# Altium schematic sheet TOP SHEET.SchDoc
size 420 x 297 mm; SheetNumber: 1; SheetTotal: 27
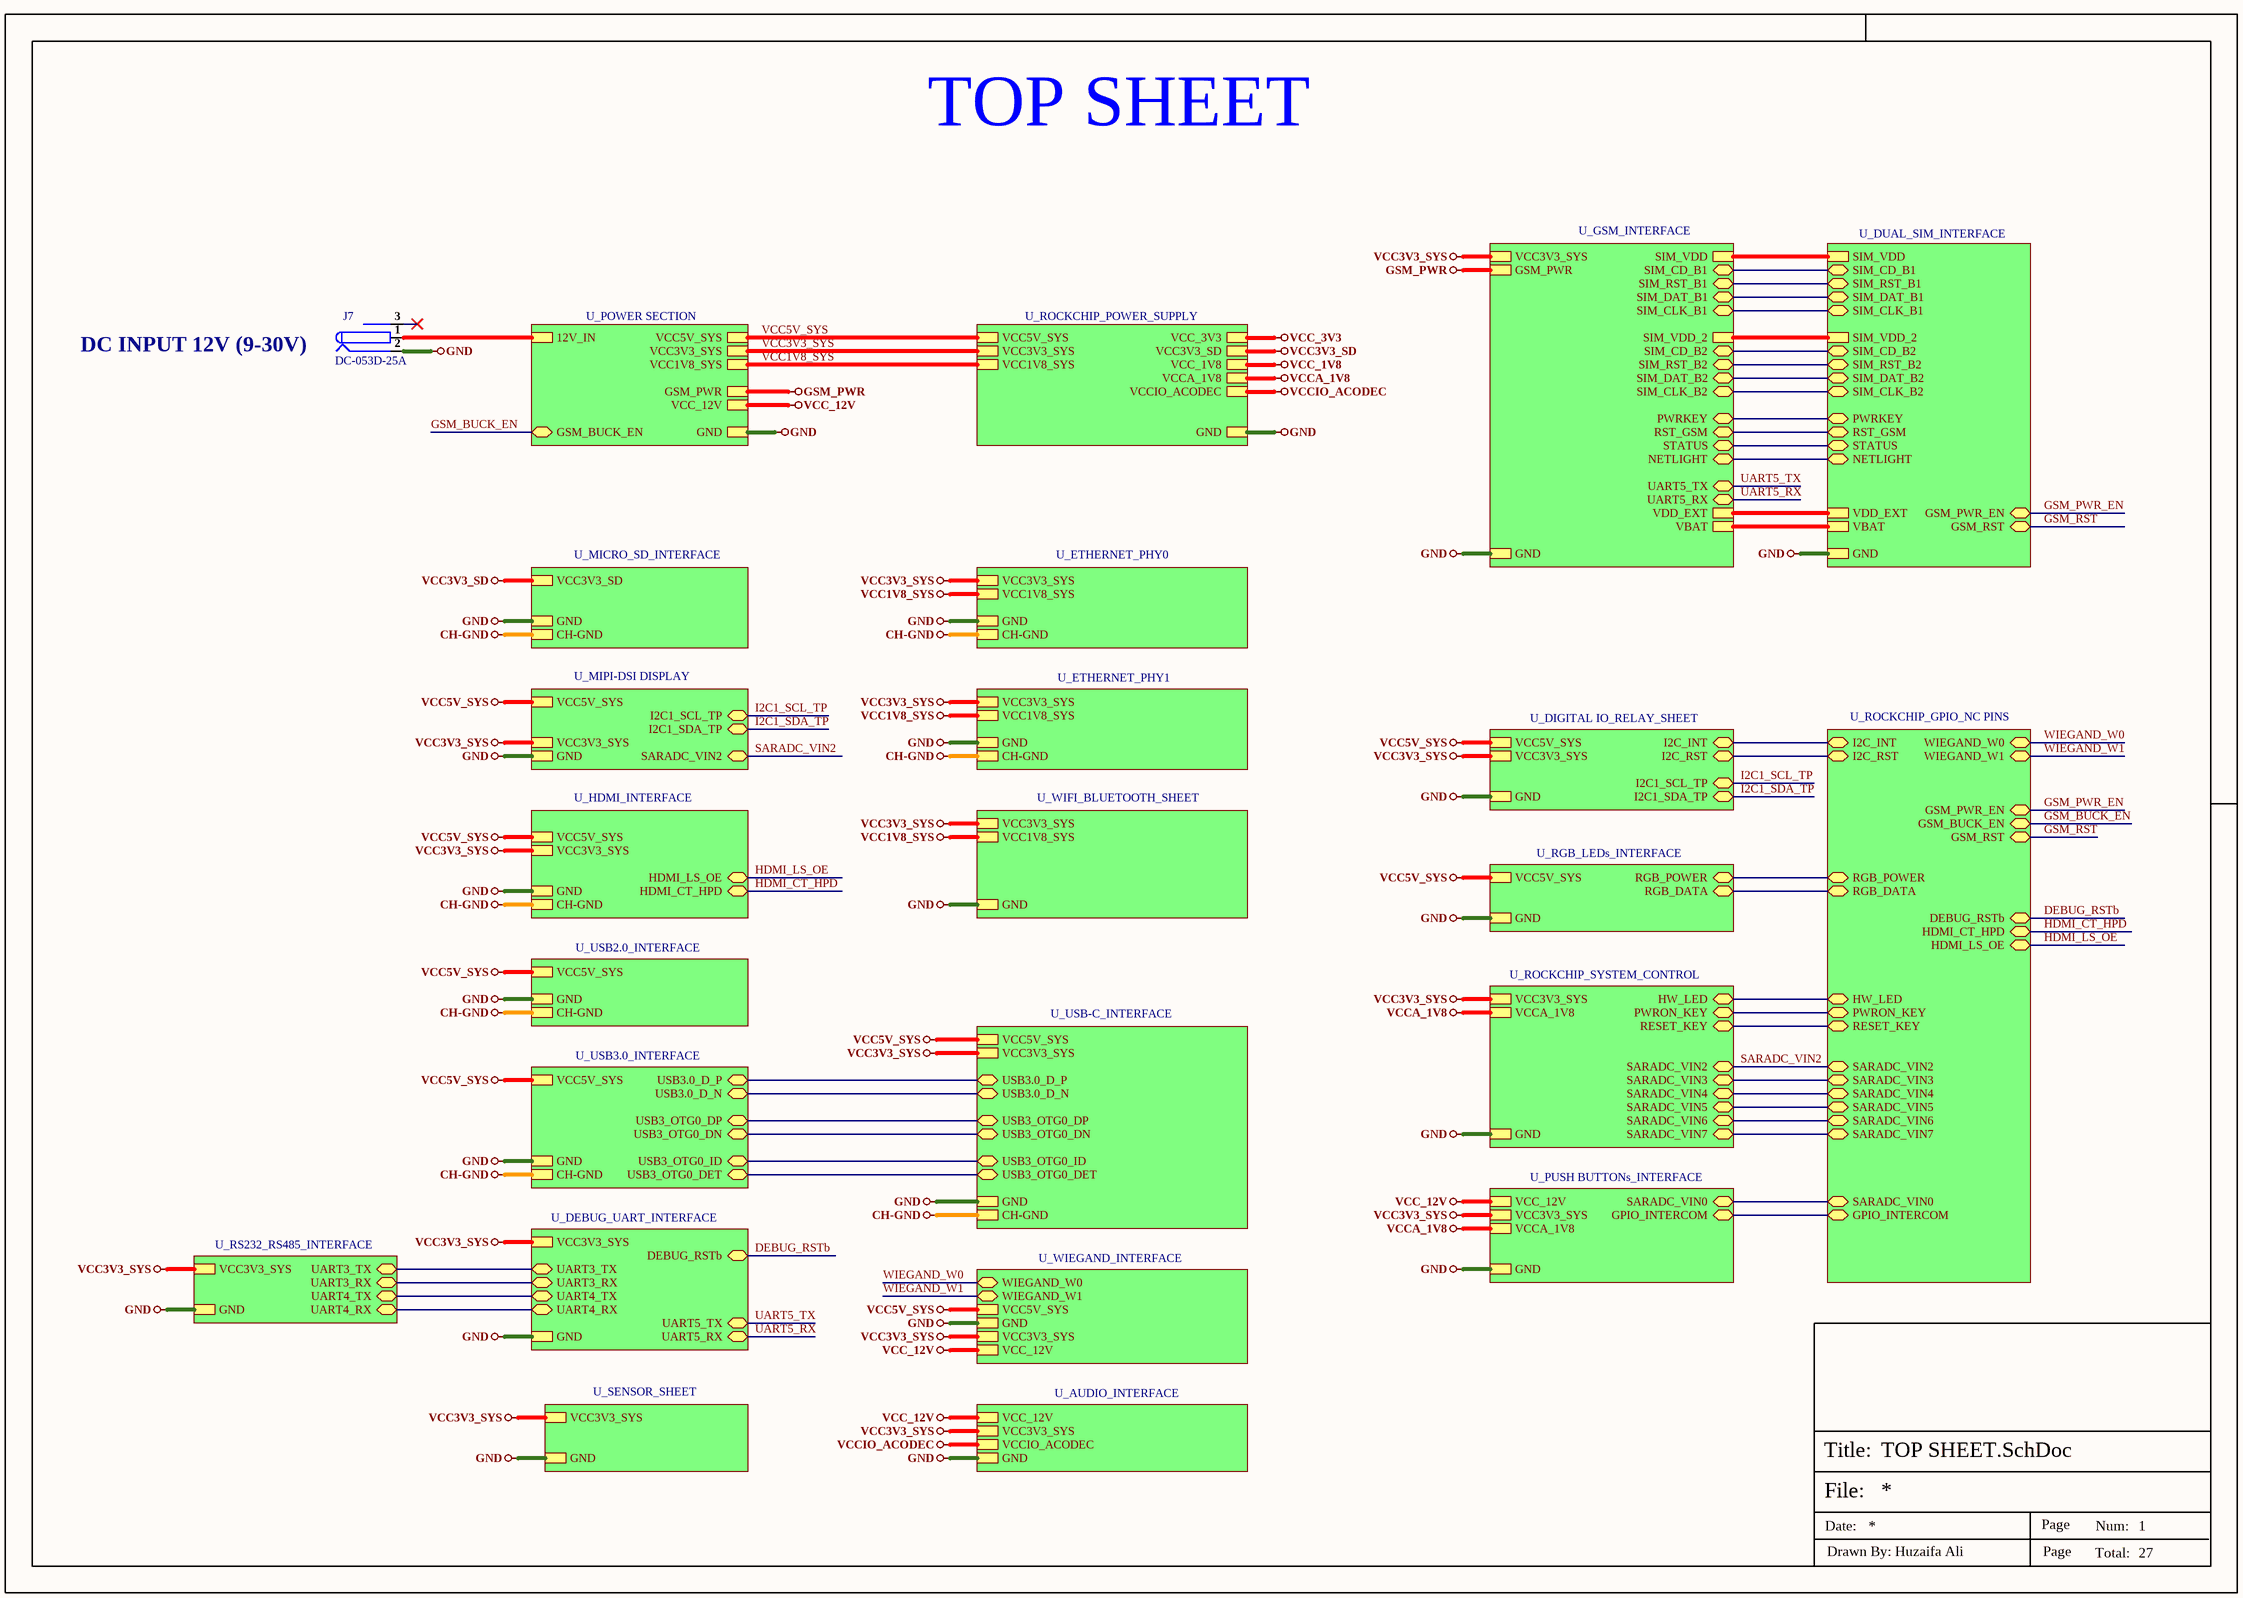
[diagram p0: TOP SHEET.SchDoc]

## Parts
J7  DC-053D-25A  [DC-053D-25A]

## Sub-sheets
U_AUDIO_INTERFACE = AUDIO_INTERFACE.SchDoc: GND, VCC3V3_SYS, VCC_12V, VCCIO_ACODEC
U_DEBUG_UART_INTERFACE = DEBUG_UART_INTERFACE.SchDoc: UART5_TX (bidir), UART5_RX (bidir), UART3_TX (bidir), UART3_RX (bidir), UART4_TX (bidir), UART4_RX (bidir), GND, VCC3V3_SYS, DEBUG_RSTb (bidir)
U_DIGITAL IO_RELAY_SHEET = DIGITAL IO_RELAY_SHEET.SchDoc: VCC5V_SYS, GND, VCC3V3_SYS, I2C_INT (bidir), I2C_RST (bidir), I2C1_SCL_TP (bidir), I2C1_SDA_TP (bidir)
U_DUAL_SIM_INTERFACE = DUAL_SIM_INTERFACE.SchDoc: SIM_CD_B2 (bidir), SIM_RST_B2 (bidir), SIM_DAT_B2 (bidir), SIM_CLK_B2 (bidir), SIM_CD_B1 (bidir), SIM_RST_B1 (bidir), SIM_DAT_B1 (bidir), SIM_CLK_B1 (bidir), SIM_VDD, SIM_VDD_2, GND, VBAT, PWRKEY (bidir), RST_GSM (bidir), STATUS (bidir), NETLIGHT (bidir), GSM_PWR_EN (bidir), GSM_RST (bidir), VDD_EXT
U_ETHERNET_PHY0 = ETHERNET_PHY0.SchDoc: GND, VCC3V3_SYS, VCC1V8_SYS, CH-GND
U_ETHERNET_PHY1 = ETHERNET_PHY1.SchDoc: GND, VCC3V3_SYS, VCC1V8_SYS, CH-GND
U_GSM_INTERFACE = GSM_INTERFACE.SchDoc: GSM_PWR, GND, SIM_CD_B2 (bidir), SIM_RST_B2 (bidir), SIM_DAT_B2 (bidir), SIM_CLK_B2 (bidir), SIM_CD_B1 (bidir), SIM_RST_B1 (bidir), SIM_DAT_B1 (bidir), SIM_CLK_B1 (bidir), PWRKEY (bidir), RST_GSM (bidir), STATUS (bidir), NETLIGHT (bidir), VDD_EXT, VBAT, VCC3V3_SYS, SIM_VDD, SIM_VDD_2, UART5_TX (bidir), UART5_RX (bidir)
U_HDMI_INTERFACE = HDMI_INTERFACE.SchDoc: VCC5V_SYS, GND, CH-GND, VCC3V3_SYS, HDMI_CT_HPD (bidir), HDMI_LS_OE (bidir)
U_MICRO_SD_INTERFACE = MICRO_SD_INTERFACE.SchDoc: GND, VCC3V3_SD, CH-GND
U_MIPI-DSI DISPLAY = MIPI-DSI DISPLAY.SchDoc: VCC5V_SYS, GND, VCC3V3_SYS, I2C1_SCL_TP (bidir), I2C1_SDA_TP (bidir), SARADC_VIN2 (bidir)
U_POWER SECTION = POWER SECTION.SchDoc: 12V_IN, VCC5V_SYS, GND, VCC3V3_SYS, GSM_PWR, VCC1V8_SYS, GSM_BUCK_EN (bidir), VCC_12V
U_PUSH BUTTONs_INTERFACE = PUSH BUTTONs_INTERFACE.SchDoc: GND, VCC3V3_SYS, VCCA_1V8, SARADC_VIN0 (bidir), GPIO_INTERCOM (bidir), VCC_12V
U_RGB_LEDs_INTERFACE = RGB_LEDs_INTERFACE.SchDoc: RGB_POWER (bidir), RGB_DATA (bidir), VCC5V_SYS, GND
U_ROCKCHIP_GPIO_NC PINS = ROCKCHIP_GPIO_NC PINS.SchDoc: WIEGAND_W1 (bidir), WIEGAND_W0 (bidir), RGB_POWER (bidir), RGB_DATA (bidir), HDMI_CT_HPD (bidir), HDMI_LS_OE (bidir), GSM_PWR_EN (bidir), GSM_RST (bidir), GSM_BUCK_EN (bidir), DEBUG_RSTb (bidir), I2C_INT (bidir), I2C_RST (bidir), SARADC_VIN0 (bidir), GPIO_INTERCOM (bidir), HW_LED (bidir), PWRON_KEY (bidir), RESET_KEY (bidir), SARADC_VIN3 (bidir), SARADC_VIN4 (bidir), SARADC_VIN5 (bidir), SARADC_VIN6 (bidir), SARADC_VIN7 (bidir), SARADC_VIN2 (bidir)
U_ROCKCHIP_POWER_SUPPLY = ROCKCHIP_PWR_SUPPLY.SchDoc: VCC5V_SYS, GND, VCC3V3_SYS, VCC3V3_SD, VCC1V8_SYS, VCCIO_ACODEC, VCCA_1V8, VCC_1V8, VCC_3V3
U_ROCKCHIP_SYSTEM_CONTROL = ROCKCHIP_SYSTEM_CONTROL.SchDoc: GND, VCC3V3_SYS, HW_LED (bidir), PWRON_KEY (bidir), RESET_KEY (bidir), SARADC_VIN3 (bidir), VCCA_1V8, SARADC_VIN4 (bidir), SARADC_VIN5 (bidir), SARADC_VIN6 (bidir), SARADC_VIN7 (bidir), SARADC_VIN2 (bidir)
U_RS232_RS485_INTERFACE = RS232_RS485_INTERFACE.SchDoc: UART3_TX (bidir), UART3_RX (bidir), UART4_TX (bidir), UART4_RX (bidir), GND, VCC3V3_SYS
U_SENSOR_SHEET = SENSOR_SHEET.SchDoc: GND, VCC3V3_SYS
U_USB2.0_INTERFACE = USB2.0_INTERFACE.SchDoc: VCC5V_SYS, GND, CH-GND
U_USB3.0_INTERFACE = USB3.0_INTERFACE.SchDoc: VCC5V_SYS, GND, CH-GND, USB3_OTG0_DP (bidir), USB3_OTG0_DN (bidir), USB3.0_D_P (bidir), USB3.0_D_N (bidir), USB3_OTG0_ID (bidir), USB3_OTG0_DET (bidir)
U_USB-C_INTERFACE = USB-C_INTERFACE.SchDoc: USB3_OTG0_DP (bidir), USB3_OTG0_DN (bidir), USB3.0_D_P (bidir), USB3.0_D_N (bidir), USB3_OTG0_ID (bidir), USB3_OTG0_DET (bidir), VCC5V_SYS, GND, CH-GND, VCC3V3_SYS
U_WIEGAND_INTERFACE = WIEGAND_INTERFACE.SchDoc: WIEGAND_W1 (bidir), WIEGAND_W0 (bidir), VCC5V_SYS, GND, VCC3V3_SYS, VCC_12V
U_WIFI_BLUETOOTH_SHEET = WIFI_BLUETOOTH_SHEET.SchDoc: GND, VCC3V3_SYS, VCC1V8_SYS

## Nets
CH-GND: sheet U_MICRO_SD_INTERFACE/CH-GND, sheet U_HDMI_INTERFACE/CH-GND, sheet U_USB2.0_INTERFACE/CH-GND, sheet U_USB3.0_INTERFACE/CH-GND, sheet U_USB-C_INTERFACE/CH-GND, sheet U_ETHERNET_PHY0/CH-GND, sheet U_ETHERNET_PHY1/CH-GND
GND: J7.2 ; sheet U_POWER SECTION/GND, sheet U_ROCKCHIP_POWER_SUPPLY/GND, sheet U_MICRO_SD_INTERFACE/GND, sheet U_HDMI_INTERFACE/GND, sheet U_MIPI-DSI DISPLAY/GND, sheet U_USB2.0_INTERFACE/GND, sheet U_USB3.0_INTERFACE/GND, sheet U_USB-C_INTERFACE/GND, sheet U_ETHERNET_PHY0/GND, sheet U_ETHERNET_PHY1/GND, sheet U_WIFI_BLUETOOTH_SHEET/GND, sheet U_GSM_INTERFACE/GND, sheet U_DUAL_SIM_INTERFACE/GND, sheet U_RS232_RS485_INTERFACE/GND, sheet U_DEBUG_UART_INTERFACE/GND, sheet U_AUDIO_INTERFACE/GND, sheet U_WIEGAND_INTERFACE/GND, sheet U_SENSOR_SHEET/GND, sheet U_ROCKCHIP_SYSTEM_CONTROL/GND, sheet U_RGB_LEDs_INTERFACE/GND, sheet U_PUSH BUTTONs_INTERFACE/GND, sheet U_DIGITAL IO_RELAY_SHEET/GND
GSM_PWR: sheet U_POWER SECTION/GSM_PWR, sheet U_GSM_INTERFACE/GSM_PWR
VCC1V8_SYS: sheet U_POWER SECTION/VCC1V8_SYS, sheet U_ROCKCHIP_POWER_SUPPLY/VCC1V8_SYS, sheet U_ETHERNET_PHY0/VCC1V8_SYS, sheet U_ETHERNET_PHY1/VCC1V8_SYS, sheet U_WIFI_BLUETOOTH_SHEET/VCC1V8_SYS
VCC3V3_SD: sheet U_ROCKCHIP_POWER_SUPPLY/VCC3V3_SD, sheet U_MICRO_SD_INTERFACE/VCC3V3_SD
VCC3V3_SYS: sheet U_POWER SECTION/VCC3V3_SYS, sheet U_ROCKCHIP_POWER_SUPPLY/VCC3V3_SYS, sheet U_HDMI_INTERFACE/VCC3V3_SYS, sheet U_MIPI-DSI DISPLAY/VCC3V3_SYS, sheet U_USB-C_INTERFACE/VCC3V3_SYS, sheet U_ETHERNET_PHY0/VCC3V3_SYS, sheet U_ETHERNET_PHY1/VCC3V3_SYS, sheet U_WIFI_BLUETOOTH_SHEET/VCC3V3_SYS, sheet U_GSM_INTERFACE/VCC3V3_SYS, sheet U_RS232_RS485_INTERFACE/VCC3V3_SYS, sheet U_DEBUG_UART_INTERFACE/VCC3V3_SYS, sheet U_AUDIO_INTERFACE/VCC3V3_SYS, sheet U_WIEGAND_INTERFACE/VCC3V3_SYS, sheet U_SENSOR_SHEET/VCC3V3_SYS, sheet U_ROCKCHIP_SYSTEM_CONTROL/VCC3V3_SYS, sheet U_PUSH BUTTONs_INTERFACE/VCC3V3_SYS, sheet U_DIGITAL IO_RELAY_SHEET/VCC3V3_SYS
VCC5V_SYS: sheet U_POWER SECTION/VCC5V_SYS, sheet U_ROCKCHIP_POWER_SUPPLY/VCC5V_SYS, sheet U_HDMI_INTERFACE/VCC5V_SYS, sheet U_MIPI-DSI DISPLAY/VCC5V_SYS, sheet U_USB2.0_INTERFACE/VCC5V_SYS, sheet U_USB3.0_INTERFACE/VCC5V_SYS, sheet U_USB-C_INTERFACE/VCC5V_SYS, sheet U_WIEGAND_INTERFACE/VCC5V_SYS, sheet U_RGB_LEDs_INTERFACE/VCC5V_SYS, sheet U_DIGITAL IO_RELAY_SHEET/VCC5V_SYS
VCC_1V8: sheet U_ROCKCHIP_POWER_SUPPLY/VCC_1V8
VCC_3V3: sheet U_ROCKCHIP_POWER_SUPPLY/VCC_3V3
VCC_12V: sheet U_POWER SECTION/VCC_12V, sheet U_AUDIO_INTERFACE/VCC_12V, sheet U_WIEGAND_INTERFACE/VCC_12V, sheet U_PUSH BUTTONs_INTERFACE/VCC_12V
VCCA_1V8: sheet U_ROCKCHIP_POWER_SUPPLY/VCCA_1V8, sheet U_ROCKCHIP_SYSTEM_CONTROL/VCCA_1V8, sheet U_PUSH BUTTONs_INTERFACE/VCCA_1V8
VCCIO_ACODEC: sheet U_ROCKCHIP_POWER_SUPPLY/VCCIO_ACODEC, sheet U_AUDIO_INTERFACE/VCCIO_ACODEC
DEBUG_RSTb: sheet U_DEBUG_UART_INTERFACE/DEBUG_RSTb, sheet U_ROCKCHIP_GPIO_NC PINS/DEBUG_RSTb
GSM_BUCK_EN: sheet U_POWER SECTION/GSM_BUCK_EN, sheet U_ROCKCHIP_GPIO_NC PINS/GSM_BUCK_EN
GSM_PWR_EN: sheet U_DUAL_SIM_INTERFACE/GSM_PWR_EN, sheet U_ROCKCHIP_GPIO_NC PINS/GSM_PWR_EN
GSM_RST: sheet U_DUAL_SIM_INTERFACE/GSM_RST, sheet U_ROCKCHIP_GPIO_NC PINS/GSM_RST
HDMI_CT_HPD: sheet U_HDMI_INTERFACE/HDMI_CT_HPD, sheet U_ROCKCHIP_GPIO_NC PINS/HDMI_CT_HPD
HDMI_LS_OE: sheet U_HDMI_INTERFACE/HDMI_LS_OE, sheet U_ROCKCHIP_GPIO_NC PINS/HDMI_LS_OE
I2C1_SCL_TP: sheet U_MIPI-DSI DISPLAY/I2C1_SCL_TP, sheet U_DIGITAL IO_RELAY_SHEET/I2C1_SCL_TP
I2C1_SDA_TP: sheet U_MIPI-DSI DISPLAY/I2C1_SDA_TP, sheet U_DIGITAL IO_RELAY_SHEET/I2C1_SDA_TP
SARADC_VIN2: sheet U_MIPI-DSI DISPLAY/SARADC_VIN2, sheet U_ROCKCHIP_SYSTEM_CONTROL/SARADC_VIN2, sheet U_ROCKCHIP_GPIO_NC PINS/SARADC_VIN2
UART5_RX: sheet U_GSM_INTERFACE/UART5_RX, sheet U_DEBUG_UART_INTERFACE/UART5_RX
UART5_TX: sheet U_GSM_INTERFACE/UART5_TX, sheet U_DEBUG_UART_INTERFACE/UART5_TX
WIEGAND_W0: sheet U_WIEGAND_INTERFACE/WIEGAND_W0, sheet U_ROCKCHIP_GPIO_NC PINS/WIEGAND_W0
WIEGAND_W1: sheet U_WIEGAND_INTERFACE/WIEGAND_W1, sheet U_ROCKCHIP_GPIO_NC PINS/WIEGAND_W1
NetJ7_1: J7.1 ; sheet U_POWER SECTION/12V_IN
(unnamed): sheet U_USB3.0_INTERFACE/USB3_OTG0_DP, sheet U_USB-C_INTERFACE/USB3_OTG0_DP
(unnamed): sheet U_USB3.0_INTERFACE/USB3_OTG0_DN, sheet U_USB-C_INTERFACE/USB3_OTG0_DN
(unnamed): sheet U_USB3.0_INTERFACE/USB3.0_D_P, sheet U_USB-C_INTERFACE/USB3.0_D_P
(unnamed): sheet U_USB3.0_INTERFACE/USB3.0_D_N, sheet U_USB-C_INTERFACE/USB3.0_D_N
(unnamed): sheet U_USB3.0_INTERFACE/USB3_OTG0_ID, sheet U_USB-C_INTERFACE/USB3_OTG0_ID
(unnamed): sheet U_USB3.0_INTERFACE/USB3_OTG0_DET, sheet U_USB-C_INTERFACE/USB3_OTG0_DET
(unnamed): sheet U_GSM_INTERFACE/SIM_CD_B2, sheet U_DUAL_SIM_INTERFACE/SIM_CD_B2
(unnamed): sheet U_GSM_INTERFACE/SIM_RST_B2, sheet U_DUAL_SIM_INTERFACE/SIM_RST_B2
(unnamed): sheet U_GSM_INTERFACE/SIM_DAT_B2, sheet U_DUAL_SIM_INTERFACE/SIM_DAT_B2
(unnamed): sheet U_GSM_INTERFACE/SIM_CLK_B2, sheet U_DUAL_SIM_INTERFACE/SIM_CLK_B2
(unnamed): sheet U_GSM_INTERFACE/SIM_CD_B1, sheet U_DUAL_SIM_INTERFACE/SIM_CD_B1
(unnamed): sheet U_GSM_INTERFACE/SIM_RST_B1, sheet U_DUAL_SIM_INTERFACE/SIM_RST_B1
(unnamed): sheet U_GSM_INTERFACE/SIM_DAT_B1, sheet U_DUAL_SIM_INTERFACE/SIM_DAT_B1
(unnamed): sheet U_GSM_INTERFACE/SIM_CLK_B1, sheet U_DUAL_SIM_INTERFACE/SIM_CLK_B1
(unnamed): sheet U_GSM_INTERFACE/PWRKEY, sheet U_DUAL_SIM_INTERFACE/PWRKEY
(unnamed): sheet U_GSM_INTERFACE/RST_GSM, sheet U_DUAL_SIM_INTERFACE/RST_GSM
(unnamed): sheet U_GSM_INTERFACE/STATUS, sheet U_DUAL_SIM_INTERFACE/STATUS
(unnamed): sheet U_GSM_INTERFACE/NETLIGHT, sheet U_DUAL_SIM_INTERFACE/NETLIGHT
(unnamed): sheet U_GSM_INTERFACE/VDD_EXT, sheet U_DUAL_SIM_INTERFACE/VDD_EXT
(unnamed): sheet U_GSM_INTERFACE/VBAT, sheet U_DUAL_SIM_INTERFACE/VBAT
(unnamed): sheet U_GSM_INTERFACE/SIM_VDD, sheet U_DUAL_SIM_INTERFACE/SIM_VDD
(unnamed): sheet U_GSM_INTERFACE/SIM_VDD_2, sheet U_DUAL_SIM_INTERFACE/SIM_VDD_2
(unnamed): sheet U_RS232_RS485_INTERFACE/UART3_TX, sheet U_DEBUG_UART_INTERFACE/UART3_TX
(unnamed): sheet U_RS232_RS485_INTERFACE/UART3_RX, sheet U_DEBUG_UART_INTERFACE/UART3_RX
(unnamed): sheet U_RS232_RS485_INTERFACE/UART4_TX, sheet U_DEBUG_UART_INTERFACE/UART4_TX
(unnamed): sheet U_RS232_RS485_INTERFACE/UART4_RX, sheet U_DEBUG_UART_INTERFACE/UART4_RX
(unnamed): sheet U_ROCKCHIP_SYSTEM_CONTROL/HW_LED, sheet U_ROCKCHIP_GPIO_NC PINS/HW_LED
(unnamed): sheet U_ROCKCHIP_SYSTEM_CONTROL/PWRON_KEY, sheet U_ROCKCHIP_GPIO_NC PINS/PWRON_KEY
(unnamed): sheet U_ROCKCHIP_SYSTEM_CONTROL/RESET_KEY, sheet U_ROCKCHIP_GPIO_NC PINS/RESET_KEY
(unnamed): sheet U_ROCKCHIP_SYSTEM_CONTROL/SARADC_VIN3, sheet U_ROCKCHIP_GPIO_NC PINS/SARADC_VIN3
(unnamed): sheet U_ROCKCHIP_SYSTEM_CONTROL/SARADC_VIN4, sheet U_ROCKCHIP_GPIO_NC PINS/SARADC_VIN4
(unnamed): sheet U_ROCKCHIP_SYSTEM_CONTROL/SARADC_VIN5, sheet U_ROCKCHIP_GPIO_NC PINS/SARADC_VIN5
(unnamed): sheet U_ROCKCHIP_SYSTEM_CONTROL/SARADC_VIN6, sheet U_ROCKCHIP_GPIO_NC PINS/SARADC_VIN6
(unnamed): sheet U_ROCKCHIP_SYSTEM_CONTROL/SARADC_VIN7, sheet U_ROCKCHIP_GPIO_NC PINS/SARADC_VIN7
(unnamed): sheet U_RGB_LEDs_INTERFACE/RGB_POWER, sheet U_ROCKCHIP_GPIO_NC PINS/RGB_POWER
(unnamed): sheet U_RGB_LEDs_INTERFACE/RGB_DATA, sheet U_ROCKCHIP_GPIO_NC PINS/RGB_DATA
(unnamed): sheet U_PUSH BUTTONs_INTERFACE/SARADC_VIN0, sheet U_ROCKCHIP_GPIO_NC PINS/SARADC_VIN0
(unnamed): sheet U_PUSH BUTTONs_INTERFACE/GPIO_INTERCOM, sheet U_ROCKCHIP_GPIO_NC PINS/GPIO_INTERCOM
(unnamed): sheet U_DIGITAL IO_RELAY_SHEET/I2C_INT, sheet U_ROCKCHIP_GPIO_NC PINS/I2C_INT
(unnamed): sheet U_DIGITAL IO_RELAY_SHEET/I2C_RST, sheet U_ROCKCHIP_GPIO_NC PINS/I2C_RST

Not connected (* = marked no-connect by the designer): J7 3*

## Notes on the sheet
- TOP SHEET
- DC INPUT 12V (9-30V)
- File:
- Title:
- Date:
- Page
- Num:
- Total:
- Drawn By: Huzaifa Ali

## Library data of the parts
J7 = DC-053D-25A: Shrouded DC Power Receptacle -20℃~+70℃ 2.5mm 6.5mm 10A 16V Plugin AC/DC Power Connectors ROHS; Manufacturer: Korean Hroparts Elec; Item Type: DC JACK; Manufacturer Part Number: DC-053D-25A; Package: Custom; LCSC Part Number: C2686352; ComponentLink1Description: LCSC; ComponentLink1URL: https://www.lcsc.com/product-detail/AC-DC-Power-Connectors_Korean-Hroparts-Elec-DC-053D-25A_C2686352.html